# EAGLE design NixieMainboard (EAGLE 9.1.3)
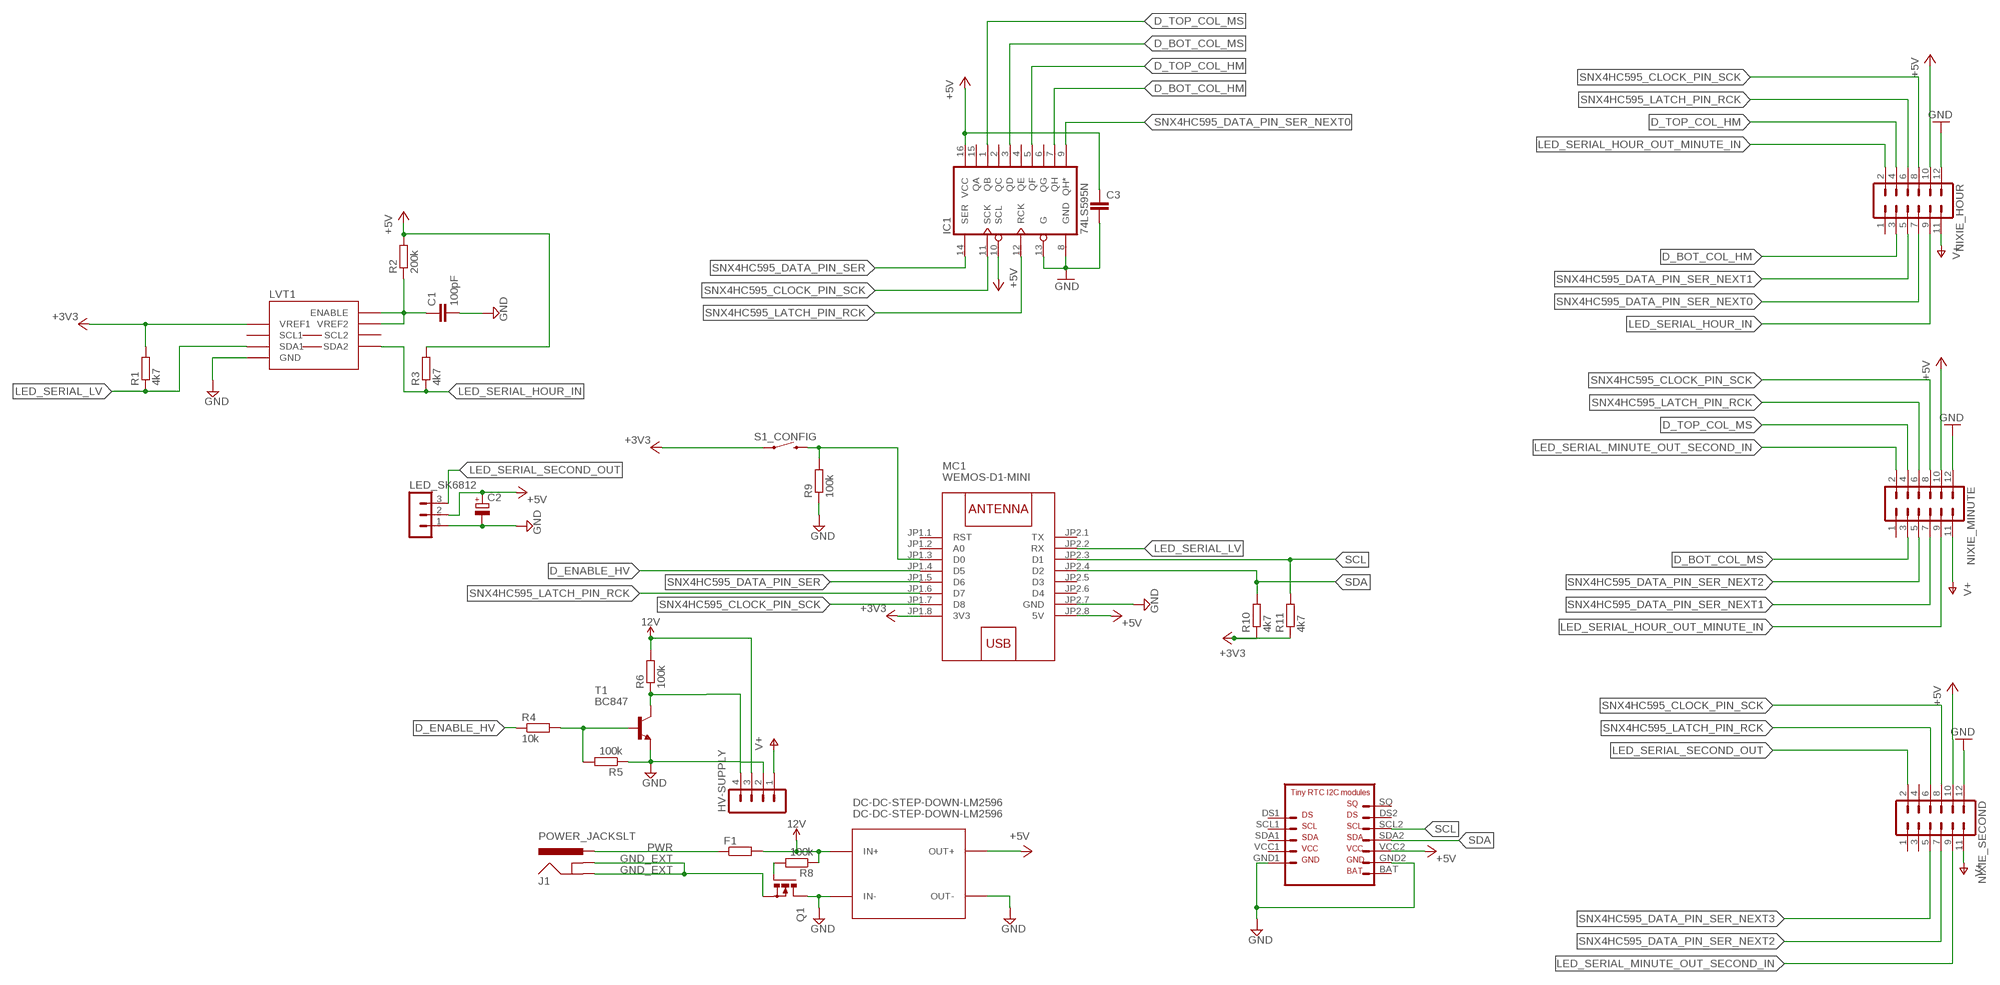
[diagram p0: schematic, sheet 1]

## Parts
C1  100pF  C-EUC0805  [C0805]
C2  CPOL-EUE5-8.5  [E5-8,5]
C3  C-EU050-024X044  [C050-024X044]
DC-DC-STEP-DOWN-LM2596  DC-DC-STEP-DOWN-LM2596  [DC-DC-STEP-DOWN-LM2596]
F1  R-EU_R2512W  [R2512W]
HV-SUPPLY  MA04-1  [MA04-1]
IC1  74LS595N  [DIL16]
J1  POWER_JACKSLT  [POWER_JACK_SLOT]
LED_SK6812  MA03-1  [MA03-1]
LVT1  IC2_LEVEL_TRANSLATER  [SOIC-8]
MC1  WEMOS-D1-MINI  [WEMOS-D1-MINI]
NIXIE_HOUR  MA06-2  [MA06-2]
NIXIE_MINUTE  MA06-2  [MA06-2]
NIXIE_SECOND  MA06-2  [MA06-2]
Q1  PMOSFET_NTO220BV  [TO220BV]
R1  4k7  R-EU_R0805  [R0805]
R2  200k  R-EU_R0805  [R0805]
R3  4k7  R-EU_R0805  [R0805]
R4  10k  R-EU_R0805  [R0805]
R5  100k  R-EU_R0805  [R0805]
R6  100k  R-EU_R0805  [R0805]
R8  100k  R-EU_R0805  [R0805]
R9  100k  R-EU_R0805  [R0805]
R10  4k7  R-EU_R0805  [R0805]
R11  4k7  R-EU_R0805  [R0805]
RTC1  RTC  [RTC]
S1_CONFIG  MOMENTARY-SWITCH-SPST-PTH-6.0MM  [TACTILE_SWITCH_PTH_6.0MM]
T1  BC847  [SOT23]

## Nets
12V [PWR]: DC-DC-STEP-DOWN-LM2596.IN+ F1.2 HV-SUPPLY.3 R6.2 R8.1
+3V3 [+3V3]: LVT1.1(VREF1) MC1.JP1.8(3V3) R1.2 R10.1 R11.1 S1_CONFIG.1
+5V [PWR]: C2.+ C3.1 DC-DC-STEP-DOWN-LM2596.OUT+ IC1.10(SCL) IC1.16(VCC) LED_SK6812.2 MC1.JP2.8(5V) NIXIE_HOUR.10 NIXIE_MINUTE.10 NIXIE_SECOND.10 R2.2 R3.2 RTC1.VCC2
D_BOT_COL_HM: IC1.7(QH) NIXIE_HOUR.3
D_BOT_COL_MS: IC1.3(QD) NIXIE_MINUTE.3
D_ENABLE_HV: MC1.JP1.4(D5) R4.1
D_TOP_COL_HM: IC1.5(QF) NIXIE_HOUR.4
D_TOP_COL_MS: IC1.1(QB) NIXIE_MINUTE.4
GND [PWR]: C1.2 C2.- C3.2 DC-DC-STEP-DOWN-LM2596.IN- DC-DC-STEP-DOWN-LM2596.OUT- HV-SUPPLY.2 IC1.8(GND) IC1.13(G) LED_SK6812.1 LVT1.4(GND) MC1.JP2.7(GND) NIXIE_HOUR.12 NIXIE_MINUTE.12 NIXIE_SECOND.12 Q1.D R5.1 R9.1 RTC1.GND1 RTC1.GND2 T1.2(E)
GND_EXT [PWR]: J1.GND@1(GNDBREAK) J1.GND@2(GND) Q1.S
LED_SERIAL_HOUR_IN: LVT1.5(SDA2) NIXIE_HOUR.9 R3.1
LED_SERIAL_HOUR_OUT_MINUTE_IN: NIXIE_HOUR.2 NIXIE_MINUTE.9
LED_SERIAL_LV: LVT1.3(SDA1) MC1.JP2.2(RX) R1.1
LED_SERIAL_MINUTE_OUT_SECOND_IN: NIXIE_MINUTE.2 NIXIE_SECOND.9
LED_SERIAL_SECOND_OUT: LED_SK6812.3 NIXIE_SECOND.2
N$1: R4.2 R5.2 T1.1(B)
N$2: HV-SUPPLY.4 R6.1 T1.3(C)
N$3: Q1.G R8.2
N$4: MC1.JP1.3(D0) R9.2 S1_CONFIG.3
N$6: C1.1 LVT1.7(VREF2) LVT1.8(ENABLE) R2.1
PWR [PWR]: F1.1 J1.PWR
SCL: MC1.JP2.3(D1) R11.2 RTC1.SCL2
SDA: MC1.JP2.4(D2) R10.2 RTC1.SDA2
SNX4HC595_CLOCK_PIN_SCK: IC1.11(SCK) MC1.JP1.7(D8) NIXIE_HOUR.8 NIXIE_MINUTE.8 NIXIE_SECOND.8
SNX4HC595_DATA_PIN_SER: IC1.14(SER) MC1.JP1.5(D6)
SNX4HC595_DATA_PIN_SER_NEXT0: IC1.9(QH*) NIXIE_HOUR.7
SNX4HC595_DATA_PIN_SER_NEXT1: NIXIE_HOUR.5 NIXIE_MINUTE.7
SNX4HC595_DATA_PIN_SER_NEXT2: NIXIE_MINUTE.5 NIXIE_SECOND.7
SNX4HC595_DATA_PIN_SER_NEXT3: NIXIE_SECOND.5
SNX4HC595_LATCH_PIN_RCK: IC1.12(RCK) MC1.JP1.6(D7) NIXIE_HOUR.6 NIXIE_MINUTE.6 NIXIE_SECOND.6
V+ [HV]: HV-SUPPLY.1 NIXIE_HOUR.11 NIXIE_MINUTE.11 NIXIE_SECOND.11
Unconnected: IC1.2(QC) IC1.4(QE) IC1.6(QG) IC1.15(QA) LVT1.2(SCL1) LVT1.6(SCL2) MC1.JP1.1(RST) MC1.JP1.2(A0) MC1.JP2.1(TX) MC1.JP2.5(D3) MC1.JP2.6(D4) NIXIE_HOUR.1 NIXIE_MINUTE.1 NIXIE_SECOND.1 NIXIE_SECOND.3 NIXIE_SECOND.4 RTC1.BAT RTC1.DS1 RTC1.DS2 RTC1.SCL1 RTC1.SDA1 RTC1.SQ RTC1.VCC1

## Library data of the parts
C1 C3 = rcl:C-EU: CAPACITOR, European symbol; SPICEPREFIX: C
C2 = rcl:CPOL-EU: POLARIZED CAPACITOR, European symbol; SPICEPREFIX: C
DC-DC-STEP-DOWN-LM2596 = diy-modules:DC-DC-STEP-DOWN-LM2596: DC/DC Step-Down Regulator based on LM2596-ADJ chip LM2596 datasheet available here: http://www.ti.com/lit/ds/symlink/lm2596.pdf Click here to find device on ebay.com <http://www.ebay.com/sch/lm2596+power+regulator>
F1 R1-R6 R8-R11 = rcl:R-EU_: RESISTOR, European symbol; SPICEPREFIX: R
HV-SUPPLY = con-lstb:MA04-1: PIN HEADER; OC_FARNELL: unknown; OC_NEWARK: unknown
IC1 = SparkFun:74*595: 8-bit SHIFT REGISTER, output latch
J1 = SparkFun-Connectors:POWER_JACK: Power Jack Connector This is the standard 5.5mm barrel jack for power. The PTH is the most common, proven, reliable, footprint. The Slot footprint only works if the mill layer is transmitted to the PCB fab house so be warned. Here are the connectors we sell at SparkFun: DC Barrel Power Jack/Connector <https://www.sparkfun.com/products/119> (PRT-00119) DC Barrel Power Jack/Connector (SMD) <https://www.sparkfun.com/products/12748> (PRT-12748) DC Barrel Jack Adapter - Breadboard Compatible <https://www.sparkfun.com/products/10811> (PRT-10811) It is used on this SparkFun product (and many, many others): SparkFun RedBoard - Programmed with Arduino <https://www.sparkfun.com/products/12757> (DEV-12757) Also, if you need a mating power supply or connector, please check these out: Wall Adapter Power Supply - 9VDC 650mA <https://www.sparkfun.com/products/298> (TOL-00298) DC Barrel Jack Adapter - Male <https://www.sparkfun.com/products/10287> (PRT-10287); PROD_ID: PRT-00119
LED_SK6812 = con-lstb:MA03-1: PIN HEADER; OC_FARNELL: unknown; OC_NEWARK: unknown
LVT1 = srg:IC2_LEVEL_TRANSLATER: I2C Level Translator PCA9306 Data Sheet <http://www.ti.com/lit/ds/symlink/pca9306.pdf> Sparkfun breakout board schematic <http://dlnmh9ip6v2uc.cloudfront.net/datasheets/BreakoutBoards/PCA9306_Breakout.pdf>
MC1 = diy-modules:WEMOS-D1-MINI: WEMOS D1 mini: Mini Wi-Fi Board based on ESP-8266 device More details can be found here: https://www.wemos.cc/product/d1-mini.html Click here to find device on ebay.com <http://www.ebay.com/sch/wemos+d1+mini+nodemcu>
NIXIE_HOUR NIXIE_MINUTE NIXIE_SECOND = con-lstb:MA06-2: PIN HEADER; OC_FARNELL: unknown; OC_NEWARK: unknown
Q1 = transistor-power:PMOSFET_N: Power MOSFET N-Channel
RTC1 = RTC:RTC
S1_CONFIG = SparkFun-Switches:MOMENTARY-SWITCH-SPST: Momentary Switch (Pushbutton) - SPST Normally-open (NO) SPST momentary switches (buttons, pushbuttons). Variants PTH-12MM - 12mm square, through-hole Momentary Pushbutton Switch - 12mm Square <https://www.sparkfun.com/products/9190> (COM-09190) PTH-6.0MM, PTH-6.0MM-KIT - 6.0mm square, through-hole Mini Pushbutton Switch <https://www.sparkfun.com/products/97> (COM-00097) KIT package intended for soldering kit's - only one side of pads' copper is exposed. PTH-RIGHT-ANGLE-KIT - Right-angle, through-hole Right Angle Tactile Button <https://www.sparkfun.com/products/10791> - Used on SparkFun BigTime Watch Kit <https://www.sparkfun.com/products/11734> SMD-12MM - 12mm square, surface-mount Tactile Button - SMD (12mm) <https://www.sparkfun.com/products/12993> (COM-12993) Used on SparkFun PicoBoard <https://www.sparkfun.com/products/11888> SMD-4.5MM - 4.5mm Square Trackball Switch Used on SparkFun Blackberry Trackballer Breakout <https://www.sparkfun.com/products/13169> SMD-4.6MMX2.8MM - 4.60mm x 2.80mm, surface mount Used on SparkFun SAMD21 Mini Breakout <https://www.sparkfun.com/products/13664> SMD-5.2MM, SMD-5.2-REDUNDANT - 5.2mm square, surface-mount Mini Pushbutton Switch - SMD <https://www.sparkfun.com/products/8720> (COM-08720) Used on Arduino Pro Mini <https://www.sparkfun.com/products/11114> REDUNDANT package connects both switch circuits together SMD-6.0X3.5MM - 6.0 x 3.5mm, surface mount Momentary Reset Switch SMD <https://www.sparkfun.com/products/8229> (COM-08229) SMD-6.2MM-TALL - 6.2mm square, surface mount Tactile Button - SMD (6mm) <https://www.sparkfun.com/products/12992> Used on SparkFun Digital Sandbox <https://www.sparkfun.com/products/12651> SMD-RIGHT-ANGLE - Right-angle, surface mount Used on SparkFun Block for Intel® Edison - Arduino <https://www.sparkfun.com/products/13036>; PROD_ID: SWCH-08441; SF_SKU: COM-00097
T1 = transistor:BC847: NPN TRANSISTOR

## Net classes
0 default: width 0.203 mm, clearance 0.203 mm
1 HV: width 0.61 mm, clearance 0.508 mm
2 PWR: width 0.813 mm, clearance 0.254 mm
3 GND: width 0.406 mm
4 +5V: width 0.406 mm
5 +3V3: width 0.305 mm

## Board
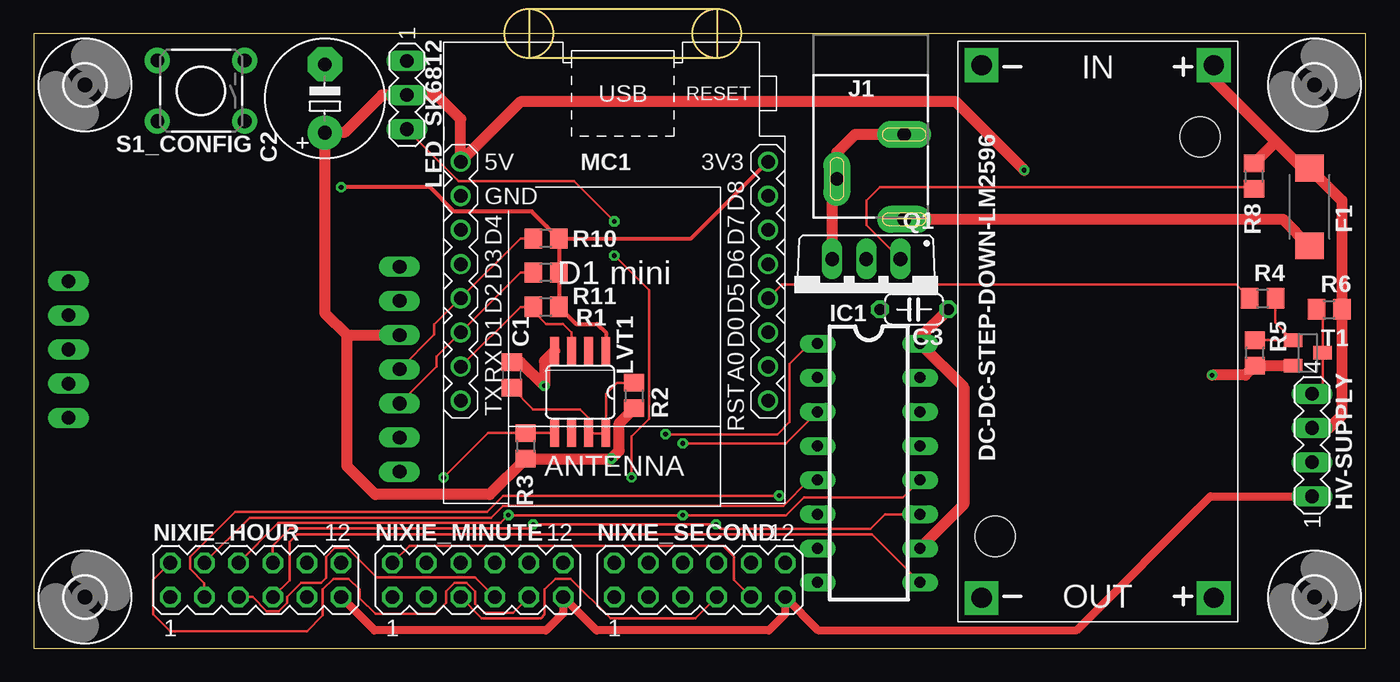
[diagram p1: board, top side]
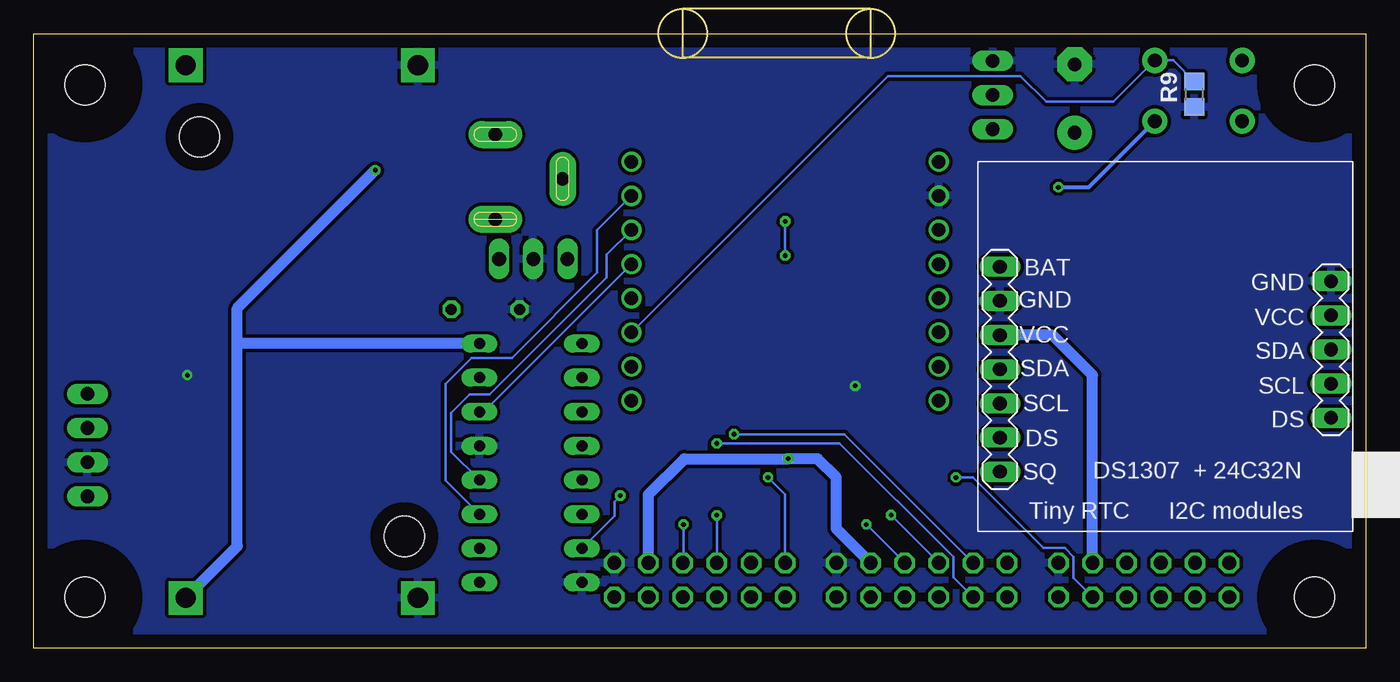
[diagram p2: board, bottom side, seen from below]

Size 99.06 x 45.72 mm. Coordinates in mm from the lower left corner, seen from the top.
Outline: 0,0 99.06,0 99.06,45.72 0,45.72 0,0
Copper layers (1*16): Top 0.035mm / dielectric 1.5mm / Bottom 0.035mm
Design rules "default *": minimum track width 6mil, minimum drill 0.35mm, track to track 6mil, track to pad 6mil, pad to pad 6mil, via to via 6mil, smd to smd 6mil, copper to edge 40mil, drill to drill 6mil, minimum pad ring 10mil, minimum via ring 8mil, stop-mask expansion 4mil, vias tented up to drill 0mil, thermal gap 10mil
Milling: area 35,43.9 to 38.6,47.5; area 49,43.9 to 52.6,47.5; 4 lines

### Footprints (pad centres in the part's own frame; a part is rotated, then mirrored left to right if it is on the bottom)
C0805 = smd 1.3 x 1.5: 1 -0.95,0; 2 0.95,0
E5-8,5 = drill 1.016 pad 2.54: + -2.54,0 | drill 1.016 pad 2.54 octagon: - 2.54,0
C050-024X044 = drill 0.813 octagon: 1 -2.54,0; 2 2.54,0
DC-DC-STEP-DOWN-LM2596 = drill 1.5 pad 2.5 square: IN+ -19.812,8.636; IN- -19.812,-8.636; OUT+ 19.812,8.636; OUT- 19.812,-8.636 | hole 3: -14.478,7.62; 15.24,-7.62
R2512W = smd 2 x 2.1: 1 -2.896,0; 2 2.896,0
MA04-1 = drill 1.016 long: 1 -3.81,0; 2 -1.27,0; 3 1.27,0; 4 3.81,0
DIL16 = drill 0.813 long: 1 -8.89,-3.81; 2 -6.35,-3.81; 3 -3.81,-3.81; 4 -1.27,-3.81; 5 1.27,-3.81; 6 3.81,-3.81; 7 6.35,-3.81; 8 8.89,-3.81; 9 8.89,3.81; 10 6.35,3.81; 11 3.81,3.81; 12 1.27,3.81; 13 -1.27,3.81; 14 -3.81,3.81; 15 -6.35,3.81; 16 -8.89,3.81
POWER_JACK_SLOT = drill 1 pad 2 long: GND@1 2.58,7.5; GND@2 7.58,10.8; PWR 2.58,13.8
MA03-1 = drill 1.016 long: 1 -2.54,0; 2 0,0; 3 2.54,0
SOIC-8 = smd 0.66 x 2.032: 1 -1.905,-3.073; 2 -0.635,-3.073; 3 0.635,-3.073; 4 1.905,-3.073; 5 1.905,3.073; 6 0.635,3.073; 7 -0.635,3.073; 8 -1.905,3.073
WEMOS-D1-MINI = drill 1: JP1.1 -11.43,9.525; JP1.2 -11.43,6.985; JP1.3 -11.43,4.445; JP1.4 -11.43,1.905; JP1.5 -11.43,-0.635; JP1.6 -11.43,-3.175; JP1.7 -11.43,-5.715; JP1.8 -11.43,-8.255; JP2.1 11.43,9.525; JP2.2 11.43,6.985; JP2.3 11.43,4.445; JP2.4 11.43,1.905; JP2.5 11.43,-0.635; JP2.6 11.43,-3.175; JP2.7 11.43,-5.715; JP2.8 11.43,-8.255
MA06-2 = drill 1.016 octagon: 1 -6.35,-1.27; 2 -6.35,1.27; 3 -3.81,-1.27; 4 -3.81,1.27; 5 -1.27,-1.27; 6 -1.27,1.27; 7 1.27,-1.27; 8 1.27,1.27; 9 3.81,-1.27; 10 3.81,1.27; 11 6.35,-1.27; 12 6.35,1.27
TO220BV = drill 1.016 long: D 0,-2.54; G -2.54,-2.54; S 2.54,-2.54
R0805 = smd 1.3 x 1.5: 1 -0.95,0; 2 0.95,0
RTC = drill 1.016 long: BAT 25.75,7.82; DS1 1.13,19.05; DS2 25.75,20.52; GND1 1.13,8.89; GND2 25.75,10.36; SCL1 1.13,16.51; SCL2 25.75,17.98; SDA1 1.13,13.97; SDA2 25.75,15.44; SQ 25.75,23.06; VCC1 1.13,11.43; VCC2 25.75,12.9
TACTILE_SWITCH_PTH_6.0MM = drill 1.016 pad 1.88: 1 -3.251,2.261; 2 3.251,2.261; 3 -3.251,-2.261; 4 3.251,-2.261
SOT23 = smd 1 x 1.4: 1 -0.95,-1.1; 2 0.95,-1.1; 3 0,1.1
3,0 = hole 3: 0,0

### Placement (x,y rotation side)
C1  35.56,20.32 90 top
C2  21.65,40.89 90 top
C3  65.47,25.21 180 top
DC-DC-STEP-DOWN-LM2596  79.12,23.56 270 top
F1  94.87,32.83 90 top
HV-SUPPLY  95.06,15.11 90 top
IC1  62.1,13.78 270 top
J1  67.31,45.72 180 top
LED_SK6812  27.75,41.15 270 top
LVT1  40.64,19.05 180 top
MC1  43.18,27.94 180 top
NIXIE_HOUR  16.51,5.08 0 top
NIXIE_MINUTE  33.02,5.08 0 top
NIXIE_SECOND  49.53,5.08 0 top
Q1  61.91,26.42 180 top
R1  38.1,25.4 0 top
R2  44.64,18.8 270 top
R3  36.58,15.05 270 top
R4  91.38,26.04 0 top
R5  90.81,21.97 90 top
R6  96.33,25.21 0 top
R8  90.74,35.12 270 top
R9  12.76,41.21 90 bottom
R10  38.1,30.48 180 top
R11  38.1,27.94 180 top
RTC1  1.46,36.2 180 bottom
S1_CONFIG  12.45,41.47 180 top
T1  94.74,21.97 270 top
U$2  [3,0]  3.81,3.81 0 top
U$3  [3,0]  95.25,41.91 0 top
U$4  [3,0]  95.25,3.81 0 top
U$5  [3,0]  3.81,41.91 0 top

### Tracks (layer width: path | path; a pad name or v marks a point on that pad's centre or on a via)
12V
  Top 0.813: HV-SUPPLY.3 96.33,16.38 97.28,17.33 R6.2 97.28,33.31 F1.2 94.32,35.73 92.33,37.72 | 92.33,37.72 87.76,42.29 DC-DC-STEP-DOWN-LM2596.IN+ | R8.1 92.33,37.65 92.33,37.72
+3V3  (via drill 0.35)
  Top 0.305: R10.1 48.9,30.48 MC1.JP1.8 | R10.1 R11.1 R1.2 40.32,24.13 41.91,24.13 42.55,23.5 LVT1.1 | R10.1 38.16,31.37 38.16,31.38 37.04,32.49 31.27,32.49 29.47,34.29 v22.86,34.29
  Bottom 0.305: v22.86,34.29 20.61,34.29 S1_CONFIG.1
+5V  (via drill 0.35)
  Top 0.813: v73.66,35.56 68.58,40.64 36.2,40.64 MC1.JP2.8 31.75,39.37 29.97,41.15 LED_SK6812.2 25.91,41.15 23.11,38.35 C2.+ 21.65,24.94 23.3,23.3 | C3.1 65.91,23.11 IC1.16 69.16,19.42 69.16,10.69 IC1.10 | R2.2 43.54,16.74 43.54,14.69 v42.95,14.1 R3.2 33.91,11.43 25.4,11.43 23.3,13.54 23.3,23.3 | 23.3,23.3 RTC1.VCC2
  Bottom 0.813: 83.91,22.86 83.91,7.59 DC-DC-STEP-DOWN-LM2596.OUT+ | 83.91,22.86 83.91,25.31 v73.66,35.56 | IC1.16 83.72,22.67 83.91,22.86 | NIXIE_HOUR.10 20.32,20.32 23.3,23.3 RTC1.VCC2 | NIXIE_SECOND.10 53.34,11.43 50.67,14.1 v42.95,14.1 40.77,14.1 39.37,12.7 39.37,8.89 NIXIE_MINUTE.10
D_BOT_COL_HM  (via drill 0.35)
  Top 0.203: NIXIE_HOUR.3 12.7,4.84 11.63,5.91 11.63,6.79 15,10.16 33.71,10.16 34.91,11.35 v55.44,11.35
  Bottom 0.203: v55.44,11.35 55.88,10.91 55.88,9.84 IC1.7
D_BOT_COL_MS  (via drill 0.35)
  Top 0.203: v48.26,15.24 55.94,15.24 IC1.3
  Bottom 0.203: NIXIE_MINUTE.3 30.68,5.28 30.68,6.79 39.13,15.24 v48.26,15.24
D_ENABLE_HV
  Top 0.203: MC1.JP1.4 55.63,27.05 89.41,27.05 R4.1
D_TOP_COL_HM
  Top 0.203: NIXIE_HOUR.4 16.07,9.72 34.03,9.72 34.92,10.6 55.75,10.6 57.66,12.51 IC1.5
D_TOP_COL_MS  (via drill 0.35)
  Top 0.203: v46.99,15.92 55.29,15.92 56.2,16.83 56.2,21.14 57.72,22.67 IC1.1
  Bottom 0.203: NIXIE_MINUTE.4 38.78,15.92 v46.99,15.92
GND  (via drill 0.35)
  Top 0.813: v87.63,20.32 90.1,20.32 R5.1 T1.2 | LVT1.4 37.97,21.36 v37.97,19.52 36.22,21.27 C1.2
  pour Bottom (isolate 0.203): 0,45.72 99.06,45.72 99.06,0 0,0
GND_EXT
  Top 0.813: J1.GND@1 61.08,38.22 59.73,36.87 J1.GND@2 59.37,34.56 Q1.S
LED_SERIAL_HOUR_IN  (via drill 0.35)
  Top 0.203: R3.1 36.83,16 | 36.83,16 38.71,16 LVT1.5 | 36.83,16 33.78,16 v30.48,12.7
  Bottom 0.203: v30.48,12.7 29.21,12.7 23.98,7.47 22.4,7.47 21.74,6.81 21.74,5.23 NIXIE_HOUR.9
LED_SERIAL_HOUR_OUT_MINUTE_IN
  Top 0.203: NIXIE_HOUR.2 8.89,5.08 8.89,2.54 10.16,1.27 20.32,1.27 21.49,2.44 21.49,4.38 22.29,5.18 23.43,5.18 24.23,4.38 24.23,3.73 25.41,2.55 29.87,2.55 30.68,3.37 30.68,4.25 31.31,4.88 32.19,4.88 32.82,4.25 32.82,3.32 33.49,2.64 35.66,2.64 NIXIE_MINUTE.9
LED_SERIAL_LV
  Top 0.203: MC1.JP2.2 36.2,25.4 R1.1 37.15,25.08 38.1,24.13 39.37,24.13 40.01,23.5 LVT1.3
LED_SERIAL_MINUTE_OUT_SECOND_IN
  Top 0.203: NIXIE_SECOND.9 52.07,5.08 52.07,6.79 51.24,7.62 27.94,7.62 NIXIE_MINUTE.2
LED_SERIAL_SECOND_OUT  (via drill 0.35)
  Top 0.203: v44.45,12.7 44.45,15.75 45.75,17.05 45.75,26.64 v43.18,29.21 | v43.18,31.75 40.16,34.77 31.59,34.77 LED_SK6812.3
  Bottom 0.203: NIXIE_SECOND.2 43.18,11.43 v44.45,12.7 | v43.18,29.21 v43.18,31.75
N$1
  Top 0.203: R5.2 T1.1 92.33,24.24 R4.2
N$2
  Top 0.203: R6.1 95.84,24.75 T1.3 95.84,19.71 HV-SUPPLY.4
N$3
  Top 0.203: 90.6,34.3 62.93,34.3 61.94,33.31 61.94,31.47 Q1.G
  Top 0.61: R8.2 90.6,34.3
N$4
  Bottom 0.203: R9.2 14.33,43.73 S1_CONFIG.3 18.78,40.64 23.75,40.64 25.68,42.57 35.53,42.57 MC1.JP1.3
N$6
  Top 0.203: C1.1 37.15,17.78 40.64,17.78 41.27,17.14 LVT1.7 LVT1.8 42.55,18.92 43.37,19.75 R2.1
PWR
  Top 0.813: F1.1 92.88,31.92 J1.PWR
SCL
  Top 0.203: RTC1.SCL2 29.97,20.98 29.97,21.72 MC1.JP2.3 36.2,27.94 R11.2
SDA
  Top 0.203: RTC1.SDA2 29.78,23.33 29.78,24.07 MC1.JP2.4 36.2,30.48 R10.2
SNX4HC595_CLOCK_PIN_SCK  (via drill 0.35)
  Top 0.203: IC1.11 63.31,9.97 62.23,8.89 51.05,8.89 v50.74,9.21 v37.15,9.21 36.84,8.9 19.06,8.9 17.78,7.62 NIXIE_HOUR.8
  Bottom 0.203: MC1.JP1.7 57.15,31.11 57.15,27.94 63.5,21.59 66.48,21.59 68.42,19.65 68.42,12.47 IC1.11 | v50.74,9.21 50.74,6.41 NIXIE_SECOND.8 | NIXIE_MINUTE.8 v37.15,9.21
SNX4HC595_DATA_PIN_SER
  Bottom 0.203: MC1.JP1.5 65.6,17.59 IC1.14
SNX4HC595_DATA_PIN_SER_NEXT0
  Top 0.203: IC1.9 62.32,8.48 19.6,8.48 19.04,7.92 19.04,5.07 NIXIE_HOUR.7
SNX4HC595_DATA_PIN_SER_NEXT1
  Top 0.203: NIXIE_MINUTE.7 32.82,5.28 25.51,5.28 23.32,7.47 22.4,7.47 21.74,6.81 21.74,5.23 21.39,4.88 19.88,4.88 18.85,3.85 18.85,3.37 18.22,2.74 17.34,2.74 16.27,3.81 NIXIE_HOUR.5
SNX4HC595_DATA_PIN_SER_NEXT2
  Top 0.203: NIXIE_SECOND.7 49.23,2.23 42.88,2.23 39.94,5.18 38.8,5.18 38,4.38 38,2.52 37.71,2.23 33.33,2.23 NIXIE_MINUTE.5
SNX4HC595_LATCH_PIN_RCK  (via drill 0.35)
  Top 0.203: NIXIE_HOUR.6 18.2,9.31 34.71,9.31 v35.3,9.91 v35.31,9.91 35.32,9.89 v48.26,9.89 55.92,9.89 57.27,11.24 64.64,11.24 IC1.12
  Bottom 0.203: MC1.JP1.6 56.45,29.27 56.45,27.57 65.14,18.87 66.66,18.87 68.01,17.52 68.01,14.61 IC1.12 | NIXIE_MINUTE.6 v35.31,9.91 | NIXIE_SECOND.6 v48.26,9.89
V+
  Top 0.61: NIXIE_HOUR.11 25.35,1.32 38.09,1.32 39.37,2.6 NIXIE_MINUTE.11 41.86,1.32 54.66,1.32 55.88,2.54 NIXIE_SECOND.11 58.34,1.35 77.55,1.35 87.5,11.3 HV-SUPPLY.1

### Text on the board
tDocu: GND | +5V | DI | SHD | 12V | GND | HV
bDocu: LED Stripe SK6812 / GND / +5V / DI | NIXIE Pinout / 1 NC / 2 SK6812_D_IN / 3 D_BOT_COL / 4 D_TOP_COL / 5 SNX4HC595_DATA_OUT / 6 SNX4HC595_LATCH_PIN_RCK / 7 SNX4HC595_DATA_IN / 8 SNX4HC595_CLOCK_PIN_SCK / 9 SK6812_D_OUT / 10 +5V / 11 +HV / 12 GND | Remove 5V pullup / before installation! | NixieControl V 1.0 / CVG, 26.05.2019 | HV-SUPPLY / SHD / 12V / GND / HV